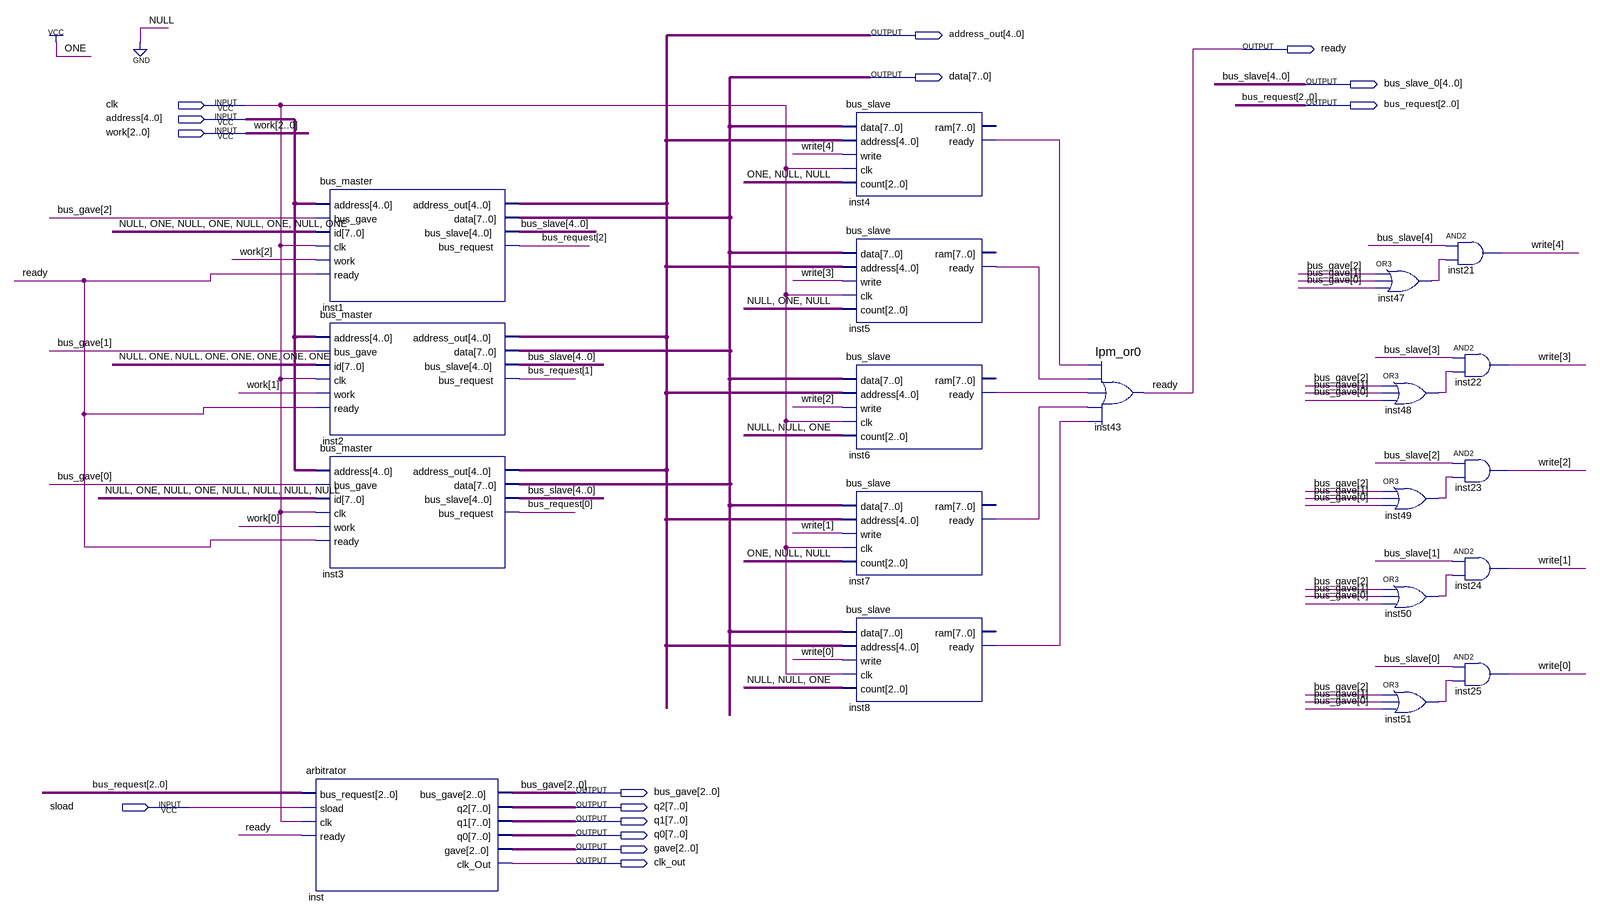
[diagram p0: schematic sheet]
// Quartus schematic lab_5.bdf as structural Verilog: 20 symbols, 15 pins
module lab_5 (
  input  clk,
  input  [4:0] address,
  input  [2:0] work,
  input  sload,
  output [4:0] address_out,
  output ready,
  output [7:0] data,
  output [4:0] bus_slave_0,
  output [2:0] bus_request,
  output [2:0] bus_gave,
  output [7:0] q2,
  output [7:0] q1,
  output [7:0] q0,
  output [2:0] gave,
  output clk_out
);

  wire inst4_ready, inst5_ready, inst6_ready, inst7_ready, inst8_ready, inst47_out, inst48_out, inst49_out,
       inst50_out, inst51_out;
  wire [4:0] write;

  bus_master inst1 (
    .address(address), .bus_gave(bus_gave[2]), .id(8'b01010101), .clk(clk), .work(work[2]), .ready(ready),
    .address_out(address_out), .data(data), .bus_slave(bus_slave_0), .bus_request(bus_request[2]));
  bus_master inst2 (
    .address(address), .bus_gave(bus_gave[1]), .id(8'b01011111), .clk(clk), .work(work[1]), .ready(ready),
    .address_out(address_out), .data(data), .bus_slave(bus_slave_0), .bus_request(bus_request[1]));
  bus_master inst3 (
    .address(address), .bus_gave(bus_gave[0]), .id(8'b01010000), .clk(clk), .work(work[0]), .ready(ready),
    .address_out(address_out), .data(data), .bus_slave(bus_slave_0), .bus_request(bus_request[0]));
  arbitrator inst (
    .bus_request(bus_request), .sload(sload), .clk(clk), .ready(ready), .bus_gave(bus_gave), .q2(q2),
    .q1(q1), .q0(q0), .gave(gave), .clk_Out(clk_out));
  bus_slave inst4 (
    .data(data), .address(address_out), .write(write[4]), .clk(clk), .count(3'b100), .ready(inst4_ready));  // open: ram
  bus_slave inst5 (
    .data(data), .address(address_out), .write(write[3]), .clk(clk), .count(3'b010), .ready(inst5_ready));  // open: ram
  bus_slave inst6 (
    .data(data), .address(address_out), .write(write[2]), .clk(clk), .count(3'b001), .ready(inst6_ready));  // open: ram
  bus_slave inst7 (
    .data(data), .address(address_out), .write(write[1]), .clk(clk), .count(3'b100), .ready(inst7_ready));  // open: ram
  bus_slave inst8 (
    .data(data), .address(address_out), .write(write[0]), .clk(clk), .count(3'b001), .ready(inst8_ready));  // open: ram
  lpm_or0 inst43 (
    .data0(inst4_ready), .data1(inst5_ready), .data2(inst6_ready), .data3(inst7_ready), .data4(inst8_ready),
    .result(ready));
  or inst47 (inst47_out, bus_gave[2], bus_gave[1], bus_gave[0]);
  or inst48 (inst48_out, bus_gave[2], bus_gave[1], bus_gave[0]);
  or inst49 (inst49_out, bus_gave[2], bus_gave[1], bus_gave[0]);
  or inst50 (inst50_out, bus_gave[2], bus_gave[1], bus_gave[0]);
  or inst51 (inst51_out, bus_gave[2], bus_gave[1], bus_gave[0]);
  and inst21 (write[4], bus_slave_0[4], inst47_out);
  and inst22 (write[3], bus_slave_0[3], inst48_out);
  and inst23 (write[2], bus_slave_0[2], inst49_out);
  and inst24 (write[1], bus_slave_0[1], inst50_out);
  and inst25 (write[0], bus_slave_0[0], inst51_out);

  // Other names for the same wires on the sheet: bus_slave[4:0] = bus_slave_0
endmodule
